# EasyEDA Pro project ProDoc_Avaota F1_2025-04-17.epro, board PCB1
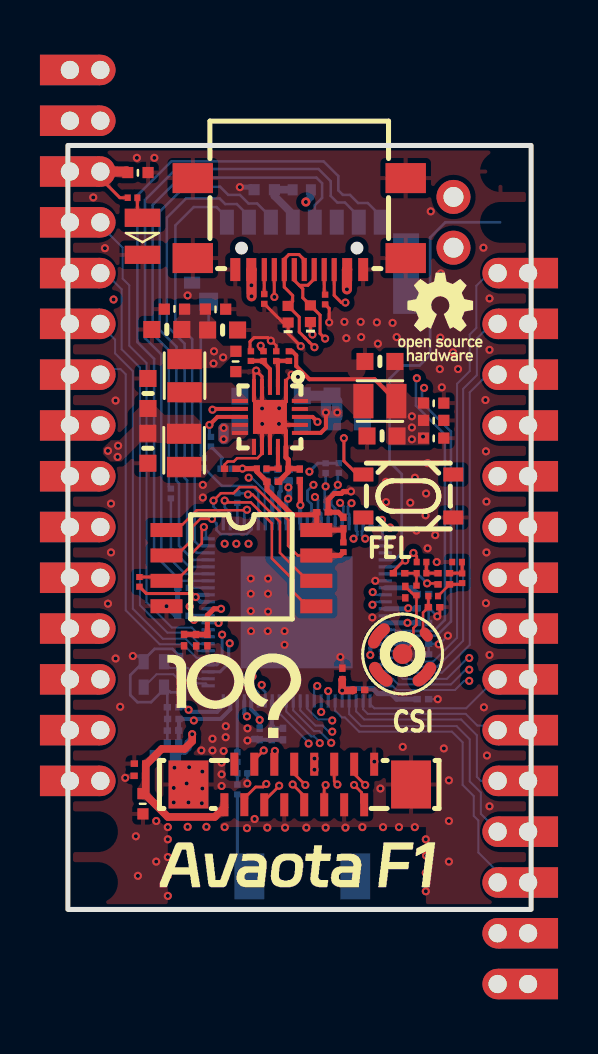
[diagram p1: board, top side]
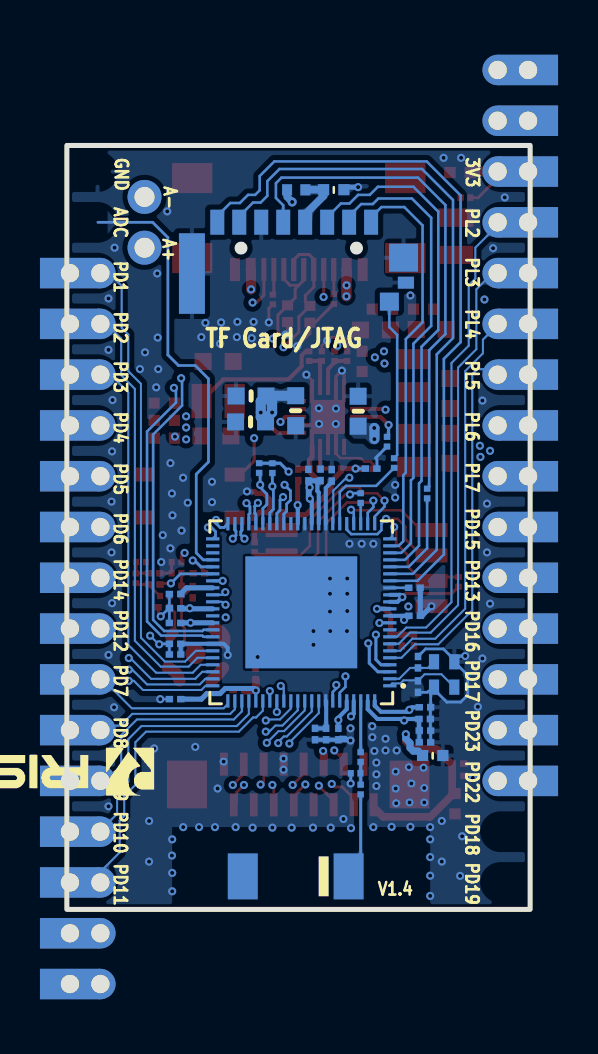
[diagram p2: board, bottom side, seen from below]

Outline 23.19 x 38.21 mm; copper layers: Top Layer, Inner1, Inner2, Inner3, Inner4, Bottom Layer. Coordinates in mm from the lower left corner of the outline.
Outline path: rectangle 0,38.21 23.19,0
Stack: Top Layer 0.035mm 外层铜厚1oz / Dielectric1 0.0994mm 3313 RC57% 4.2mil / Inner1 0.0152mm 内层铜厚 / Dielectric2 0.55mm 0.55mm H/H No copper / Inner2 0.0152mm 内层铜厚 / Dielectric3 0.1088mm 2116 RC54% 4.9mil / Inner3 0.0152mm 内层铜厚 / Dielectric4 0.55mm 0.55mm H/H No copper / Inner4 0.0152mm 内层铜厚 / Dielectric5 0.0994mm 3313 RC57% 4.2mil / Bottom Layer 0.035mm 外层铜厚1oz

## Design rules (mm)
net D0+: DP4
net D0-: DP4
net MIPIA-CSI-CK0P: DP1
net MIPIA-CSI-D0P: DP2
net MIPIA-CSI-D1P: DP3
net MIPIA-CSI-CK0N: DP1
net MIPIA-CSI-D0N: DP2
net MIPIA-CSI-D1N: DP3
template: 6L BGA
spacing safeClearance (default): track to track 0.102, other pairs 0 to 0.3
track width trackWidth (default): min 0.089, default 0.102, max 2.54
differential pair differentialPair (default): width min 0.102, default 0.254, max 2.54; gap min 0.102, default 0.102
via viaSize (default): diameter min 0.406, default 0.406, max 10; hole min 0.203, default 0.3, max 5.999
pour e3003 uses POWERCopper
pour e1913 uses POWERCopper

## Placement (name value [footprint] x y rotation side)
ANT1  CA-C03  [ANT-SMD_CA-C03]  11.74 1.65 180 bottom
C1  4.7uF  [C0201 NSK]  8.14 22.04 0 top
C2  1uF  [C0201 NSK]  11.1 21.72 270 bottom
C3  1uF  [C0201 NSK]  5.28 9.53 0 bottom
C4  1uF  [C0201 NSK]  5.78 14.69 180 bottom
C5  100nF  [C0201 NSK]  5.26 10.11 180 bottom
C10  100nF  [C0201 NSK]  17.78 10.52 0 bottom
C11  10pF  [C0201 NSK]  5.61 11.15 90 bottom
C12  10pF  [C0201 NSK]  5.61 12.37 90 bottom
C13  100nF  [C0201 NSK]  3.61 7.29 180 top
C14  100nF  [C0201 NSK]  3.59 6.68 180 top
C15  100nF  [C0201 NSK]  7.95 22.05 180 bottom
C16  100nF  [C0201 NSK]  14.58 10.97 0 top
C17  100nF  [C0201 NSK]  13.74 11.79 90 top
C18  100nF  [C0201 NSK]  10.26 21.39 0 top
C19  100nF  [C0201 NSK]  9.93 21.72 90 bottom
C20  100nF  [C0201 NSK]  10.77 8.76 270 bottom
C21  100nF  [C0201 NSK]  17.78 13.28 0 bottom
C22  100nF  [C0201 NSK]  17.78 12.75 0 bottom
C23  100nF  [C0201 NSK]  5.78 16.08 180 bottom
C24  100nF  [C0201 NSK]  10.21 8.76 270 bottom
C25  2.2uF  [C0201 NSK]  17.78 15.06 0 bottom
C26  470nF  [C0201 NSK]  17.78 15.77 0 bottom
C27  100nF  [C0201 NSK]  16.59 16.81 0 top
C28  100nF  [C0201 NSK]  18.82 16.26 0 top
C29  4.7uF  [C0201 NSK]  18.82 16.81 0 top
C30  33pF  [C0201 NSK]  16.89 15.88 90 top
C31  33pF  [C0201 NSK]  18.34 15.11 0 top
C32  100nF  [C0201 NSK]  6.42 13.46 270 top
C33  100nF  [C0201 NSK]  6.99 13.46 270 top
C34  100nF  [C0201 NSK]  5.82 13.46 270 top
C35  100nF  [C0201 NSK]  11.61 21.74 90 top
C37  100nF  [C0201 NSK]  12.75 19.86 0 top
C38  100nF  [C0201 NSK]  13.79 19.33 90 top
C39  100nF  [C0201 NSK]  5.26 8.94 180 bottom
C40  100nF  [C0201 NSK]  9.6 8.76 270 bottom
C41  100nF  [C0201 NSK]  5.26 8.36 180 bottom
C42  100nF  [C0201 NSK]  10.49 21.74 90 bottom
C43  22uF  [C0603-NSK]  4.01 23.06 90 top
C44  22uF  [C0603-NSK]  4.95 29.01 0 top
C45  22uF  [C0603-NSK]  15.73 23.68 0 top
C46  22uF  [C0603-NSK]  13.97 25.68 180 bottom
C47  22uF  [C0603-NSK]  14 24.38 180 bottom
C48  22uF  [C0603-NSK]  8.61 24.92 270 bottom
C49  22uF  [C0603-NSK]  11.74 24.94 90 bottom
C50  22uF  [C0603-NSK]  15.62 27.41 0 top
C51  22uF  [C0603-NSK]  7.75 28.98 180 top
C52  22uF  [C0603-NSK]  4.01 25.81 270 top
C53  100nF  [C0402-NSK]  4.88 7.7 0 bottom
C54  100nF  [C0402-NSK]  3.76 5.28 90 top
C55  100nF  [C0402-NSK]  3.51 36.86 180 top
C56  100nF  [C0402-NSK]  18.31 23.57 180 top
C57  100nF  [C0402-NSK]  18.31 25.32 180 top
C58  100nF  [C0402-NSK]  18.31 24.46 180 top
C59  100nF  [C0402-NSK]  5.33 30.02 0 top
C60  100nF  [C0402-NSK]  7.39 30.02 180 top
C61  100nF  [C0402-NSK]  8.41 27.41 90 top
C62  100nF  [C0201 NSK]  17.78 14.33 0 bottom
C63  100nF  [C0402-NSK]  9.83 36 0 bottom
D1  0402ESDA-05N  [D0402]  11.02 29.77 90 top
D2  0402ESDA-05N  [D0402]  12.14 29.79 90 top
H3  -  [HDR-TH_2P-P2.54-V-F]  19.3 34.37 90 top
H4  -  [2.54PHSM-1X15P]  0.36 20.4 90 top
H5  -  [2.54PHSM-1X15P]  22.78 17.86 270 top
L1  2.2uH  [IND-SMD_L2.0-W1.6]  5.82 22.96 90 top
L2  2.2uH  [IND-SMD_L2.0-W1.6]  5.84 26.7 90 top
L3  2.2uH  [IND-SMD_L2.0-W1.6]  15.62 25.43 0 top
LED1  -  [RGBLED_0807]  3.73 33.68 270 top
MIC1  MIC-4013-G-G00  [MIC-SMD_MIC-4013-G-G00]  17.35 13.26 0 top
P1  AFC11-S16ICC-00  [FPC-SMD_16P-L13.5-W2.0-P0.50]  11.61 6.25 180 top
R1  NC  [R0201 NSK]  8.74 6.81 0 bottom
R2  0  [R0201 NSK]  8.48 7.62 270 bottom
R3  0  [R0201 NSK]  8.48 5.99 270 bottom
R4  33  [R0201 NSK]  5.16 20.8 270 bottom
R5  33  [R0201 NSK]  8.48 20.57 270 bottom
R6  5.1K  [R0201 NSK]  3.24 35.6 0 top
R7  680K  [R0201 NSK]  9.7 22.05 180 top
R8  10K  [R0201 NSK]  6.81 22.33 270 bottom
R9  150K  [R0201 NSK]  10.8 22.05 180 top
R10  150K  [R0201 NSK]  9.8 27.67 90 top
R11  100K  [R0201 NSK]  9.16 27.67 270 top
R12  75K  [R0201 NSK]  11.07 27.67 90 top
R13  100K  [R0201 NSK]  10.43 27.67 270 top
R14  10K  [R0201 NSK]  3.58 16.38 270 top
R15  5.1K  [R0201 NSK]  9.83 30.53 90 top
R16  5.1K  [R0201 NSK]  12.88 30.51 270 top
R17  10K  [R0201 NSK]  13.79 18.11 270 top
R18  1.5K  [R0201 NSK]  17.7 16.81 0 top
R19  1.5K  [R0201 NSK]  19.74 16.56 90 top
R20  33  [R0201 NSK]  17.45 15.95 270 top
R21  33  [R0201 NSK]  18.29 15.67 180 top
R22  1K  [R0201 NSK]  19.48 17.37 0 top
R23  1K  [R0201 NSK]  17.7 17.37 180 top
R24  2K  [R0201 NSK]  12.9 22.07 270 bottom
R25  2K  [R0201 NSK]  13.56 22.08 270 bottom
R26  10K  [R0201 NSK]  7.16 23.39 90 bottom
R27  1  [R0402-NSK]  11.71 35.99 0 bottom
SW1  TS3425BA  [SW-SMD_4P-L4.2-W3.2-P2.15-LS4.6-1]  17.04 20.68 180 top
U1  V821x2-xXX  [QFN-88_L9.0-W9.0-P0.35-BL-EP5.26]  11.46 14.86 90 bottom
U2  MUP-M617-2  [TF-SMD_MUP-M617-2]  11.18 32.39 180 bottom
U3  EA3036CQBR  [WQFN-20_L3.0-W3.0-P0.40-BL-EP]  10.12 24.63 180 top
U4  PY25Q128HA-SUH-IT  [SOP-8_L5.2-W5.3-P1.27-LS7.9-BL]  8.69 17.07 270 top
USB1  TYPE-C 16P QTGM027  [USB-C-SMD_TYPE-C-16P-QTGM027]  11.58 34.29 180 top
X1  40MHz  [osc-smd_4p-l2.0-w1.6-bl]  4.3 11.75 90 bottom

## Footprints (pads in the part's own frame, mm; a bottom-side part is the same pattern mirrored in y, then rotated)
2.54PHSM-1X15P
  rect 1.524x3 hole 0.914: 1(21.59,0.254) 2(19.05,0.254) 3(16.51,0.254) 4(13.97,0.254) 5(11.43,0.254) 6(8.89,0.254) 7(6.35,0.254) 8(3.81,0.254) 9(1.27,0.254) 10(-1.27,0.254) 11(-3.81,0.254) 12(-6.35,0.254) 13(-8.89,0.254) 14(-11.43,0.254) 15(-13.97,0.254)
  round 1.524 hole 0.914: 1(21.59,-1.27) 2(19.05,-1.27) 3(16.51,-1.27) 4(13.97,-1.27) 5(11.43,-1.27) 6(8.89,-1.27) 7(6.35,-1.27) 8(3.81,-1.27) 9(1.27,-1.27) 10(-1.27,-1.27) 11(-3.81,-1.27) 12(-6.35,-1.27) 13(-8.89,-1.27) 14(-11.43,-1.27) 15(-13.97,-1.27)
ANT-SMD_CA-C03
  rect 1.5x2.3 smd: 1(-2.65,0) 2(2.65,0)
C0201 NSK
  rect 0.368x0.324 smd: 1(-0.292,0) 2(0.28,0)
C0402-NSK
  rect 0.559x0.559 smd: 1(-0.508,0) 2(0.508,0)
C0603-NSK
  rect 0.85x0.85 smd: 1(-0.75,0) 2(0.75,0)
D0402
  rect 0.505x0.551 smd: 1(-0.416,0) 2(0.416,0)
FPC-SMD_16P-L13.5-W2.0-P0.50
  rect 0.4x1.15 smd: 1(-3.725,-1.012) 2(-3.225,1.016) 3(-2.724,-1.012) 4(-2.224,1.016) 5(-1.726,-1.012) 6(-1.224,1.016) 7(-0.726,-1.012) 8(-0.223,1.016) 9(0.276,-1.012) 10(0.775,1.016) 11(1.274,-1.012) 12(1.776,1.016) 13(2.274,-1.014) 14(2.774,1.011) 15(3.272,-1.016) 16(3.772,1.014)
  rect 2x2.4 smd: 17(5.572,0.001) 18(-5.572,0)
HDR-TH_2P-P2.54-V-F
  round 1.7 hole 1: 1(-1.27,0) 2(1.27,0)
IND-SMD_L2.0-W1.6
  rect 1x1.72 smd: 1(0.828,0) 2(-0.828,0)
MIC-SMD_MIC-4013-G-G00
  round 1 smd: 1(-0.591,-0.485)
  oval 0.508x0.762 smd rot 39: 2(0.591,0.485)
osc-smd_4p-l2.0-w1.6-bl
  rect 0.762x0.508 smd: 1(-0.635,-0.508) 2(0.635,-0.508) 3(0.635,0.508) 4(-0.635,0.508)
QFN-88_L9.0-W9.0-P0.35-BL-EP5.26
  rect 0.16x0.665 smd: 1(-3.675,-4.433) 2(-3.325,-4.433) 3(-2.975,-4.433) 4(-2.625,-4.433) 5(-2.275,-4.433) 6(-1.925,-4.433) 7(-1.575,-4.433) 8(-1.225,-4.433) 9(-0.875,-4.433) 10(-0.525,-4.433) 11(-0.175,-4.433) 12(0.175,-4.433) 13(0.525,-4.433) 14(0.875,-4.433) 15(1.225,-4.433) 16(1.575,-4.433) 17(1.925,-4.433) 18(2.275,-4.433) 19(2.625,-4.433) 20(2.975,-4.433) 21(3.325,-4.433) 22(3.675,-4.433) 45(3.675,4.433) 46(3.325,4.433) 47(2.975,4.433) 48(2.625,4.433) 49(2.275,4.433) 50(1.925,4.433) 51(1.575,4.433) 52(1.225,4.433) 53(0.875,4.433) 54(0.525,4.433) 55(0.175,4.433) 56(-0.175,4.433) 57(-0.525,4.433) 58(-0.875,4.433) 59(-1.225,4.433) 60(-1.575,4.433) 61(-1.925,4.433) 62(-2.275,4.433) 63(-2.625,4.433) 64(-2.975,4.433) 65(-3.325,4.433) 66(-3.675,4.433)
  rect 0.665x0.16 smd: 23(4.433,-3.675) 24(4.433,-3.325) 25(4.433,-2.975) 26(4.433,-2.625) 27(4.433,-2.275) 28(4.433,-1.925) 29(4.433,-1.575) 30(4.433,-1.225) 31(4.433,-0.875) 32(4.433,-0.525) 33(4.433,-0.175) 34(4.433,0.175) 35(4.433,0.525) 36(4.433,0.875) 37(4.433,1.225) 38(4.433,1.575) 39(4.433,1.925) 40(4.433,2.275) 41(4.433,2.625) 42(4.433,2.975) 43(4.433,3.325) 44(4.433,3.675) 67(-4.433,3.675) 68(-4.433,3.325) 69(-4.433,2.975) 70(-4.433,2.625) 71(-4.433,2.275) 72(-4.433,1.925) 73(-4.433,1.575) 74(-4.433,1.225) 75(-4.433,0.875) 76(-4.433,0.525) 77(-4.433,0.175) 78(-4.433,-0.175) 79(-4.433,-0.525) 80(-4.433,-0.875) 81(-4.433,-1.225) 82(-4.433,-1.575) 83(-4.433,-1.925) 84(-4.433,-2.275) 85(-4.433,-2.625) 86(-4.433,-2.975) 87(-4.433,-3.325) 88(-4.433,-3.675)
  rect 5.6x5.6 smd: 89(0,0)
R0201 NSK
  rect 0.303x0.324 smd: 1(-0.241,0) 2(0.241,0)
R0402-NSK
  rect 0.5x0.559 smd: 1(-0.457,0) 2(0.458,0)
RGBLED_0807
  rect 0.91x1.778 smd: 1(-0.914,0) 2(0.94,0)
SOP-8_L5.2-W5.3-P1.27-LS7.9-BL
  rect 0.7x1.6 smd: 1(-1.905,-3.75) 2(-0.635,-3.75) 3(0.635,-3.75) 4(1.905,-3.75) 5(1.905,3.75) 6(0.635,3.75) 7(-0.635,3.75) 8(-1.905,3.75)
SW-SMD_4P-L4.2-W3.2-P2.15-LS4.6-1
  rect 1x0.7 smd: 1(-2.25,1.075) 2(2.25,1.075) 3(-2.25,-1.075) 4(2.25,-1.075)
TF-SMD_MUP-M617-2
  rect 0.7x1.25 smd: 1(3.215,1.988) 2(2.115,1.988) 3(1.015,1.988) 4(-0.085,1.988) 5(-1.185,1.988) 6(-2.285,1.988) 7(-3.385,1.988) 8(-4.485,1.988)
  rect 0.81x0.6 smd: 9(4.96,-1.038)
  rect 0.95x0.9 smd: 10(4.13,-1.988)
  rect 1.45x1.4 smd: 11(4.84,0.212)
  rect 1.3x4.03 smd: 12(-5.755,-0.583)
USB-C-SMD_TYPE-C-16P-QTGM027
  rect 2.02x1.5 smd: 17(5.33,1.712) 18(5.33,-2.288) 19(-5.33,-2.288) 20(-5.33,1.712)
  rect 0.5x1.15 smd: A1(-3.2,2.288) A4(-2.4,2.288) A9(2.4,2.288) A12(3.2,2.288)
  rect 0.26x1.15 smd: A5(-1.25,2.288) A6(-0.25,2.288) A7(0.25,2.288) A8(1.25,2.288) B5(1.75,2.288) B6(0.75,2.288) B7(-0.75,2.288) B8(-1.75,2.288)
WQFN-20_L3.0-W3.0-P0.40-BL-EP
  rect 0.2x0.8 smd: 1(-0.8,-1.5) 2(-0.4,-1.5) 3(0,-1.5) 4(0.4,-1.5) 5(0.8,-1.5) 11(0.8,1.5) 12(0.4,1.5) 13(0,1.5) 14(-0.4,1.5) 15(-0.8,1.5)
  rect 0.8x0.2 smd: 6(1.5,-0.8) 7(1.5,-0.4) 8(1.5,0) 9(1.5,0.4) 10(1.5,0.8) 16(-1.5,0.8) 17(-1.5,0.4) 18(-1.5,0.001) 19(-1.5,-0.4) 20(-1.5,-0.8)
  rect 1.7x1.7 smd: 21(0,0)

## Nets
0V9: C19.1 C20.1 C21.1 C22.1 C23.1 C24.1 C45.2 C50.2 C56.2 C57.2 C58.2 L3.1 R12.2 U1.15 U1.30 U1.33 U1.60 U1.81
1V5: C2.2 C3.2 C39.1 C40.1 C41.1 C42.1 C44.2 C51.2 C59.2 C60.2 C61.2 L2.1 R10.2 U1.31 U1.32 U1.84 U1.87
1V8: C32.1 C33.1 C34.1 C35.1 R24.1 R25.1 U1.12 U1.34
1V8-AON: C4.1 C5.1 U1.11 U1.88
3V3: C1.2 C10.1 C13.1 C14.1 C15.1 C16.1 C17.1 C18.1 C37.1 C38.1 C43.2 C52.2 C53.2 C54.2 C55.2 C62.1 H4.1 L1.1 P1.16 R6.1 R7.2 R14.2 R17.1 R27.2 U1.13 U1.14 U1.57 U1.71 U1.85 U4.8
AVCC: C25.1 R23.2 U1.55
GND: C1.1 C2.1 C3.1 C4.2 C5.2 C10.2 C11.1 C12.2 C13.2 C14.2 C15.2 C16.2 C17.2 C18.2 C19.2 C20.2 C21.2 C22.2 C23.2 C24.2 C25.2 C26.2 C30.1 C31.2 C32.2 C33.2 C34.2 C35.2 C37.2 C38.2 C39.2 C40.2 C41.2 C42.2 C43.1 C44.1 C45.1 C46.1 C47.1 C48.1 C49.1 C50.1 C51.1 C52.1 C53.1 C54.1 C55.1 C56.1 C57.1 C58.1 C59.1 C60.1 C61.1 C62.2 C63.1 D1.1 D2.1 H5.15 LED1.2 P1.1 P1.4 P1.7 P1.10 P1.17 P1.18 R1.2 R9.1 R11.1 R13.1 R15.1 R16.2 R22.1 R26.1 SW1.1 U1.51 U1.89 U2.6 U2.9 U2.11 U2.12 U3.1 U3.4 U3.5 U3.12 U3.13 U3.15 U3.17 U3.21 U4.4 USB1.17 USB1.18 USB1.19 USB1.20 USB1.A1 USB1.A12 X1.2 X1.4
VBUS: C46.2 C47.2 C48.2 C49.2 U3.7 U3.9 U3.10 U3.16 U3.19 USB1.A4 USB1.A9
D0+: D1.2 U1.59 USB1.A6 USB1.B6
D0-: D2.2 U1.58 USB1.A7 USB1.B7
FEL: SW1.4 U1.29
GPADC0: H5.14 U1.48
HXIN: C11.2 U1.1 X1.1
HXOUT: C12.1 U1.2 X1.3
LINEOUTN: H3.2 U1.54
LINEOUTP: H3.1 U1.53
MICINN: C28.1 U1.50
MICINP: C27.1 U1.49
MIPIA-CSI-CK0N: P1.8 U1.40
MIPIA-CSI-CK0P: P1.9 U1.41
MIPIA-CSI-D0N: P1.2 U1.42
MIPIA-CSI-D0P: P1.3 U1.43
MIPIA-CSI-D1N: P1.5 U1.44
MIPIA-CSI-D1P: P1.6 U1.45
MIPIA_MCLK: P1.12 U1.36
MIPIA_RSTN: P1.11 U1.37
PD1: H5.13 U1.61
PD2: H5.12 U1.62
PD3: H5.11 U1.63
PD4: H5.10 U1.64
PD5: H5.9 U1.65
PD6: H5.8 U1.66
PD7: H5.5 U1.67
PD8: H5.4 U1.68
PD9: H5.3 U1.69
PD10: H5.2 U1.70
PD11: H5.1 U1.72
PD12: H5.6 U1.73
PD13: H4.9 U1.74
PD14: H5.7 U1.75
PD15: H4.8 U1.76
PD16: H4.10 U1.77
PD17: H4.11 U1.78
PD18: H4.14 U1.79
PD19: H4.15 U1.80
PD22: H4.13 U1.82
PD23: H4.12 U1.83
PL2: H4.2 U1.8
PL3: H4.3 U1.7
PL6: H4.6 U1.4
PL7: H4.7 U1.3
PMC_EN0: R26.2 U1.10 U3.8 U3.18
SDC0_CLK: R4.1 U2.5
SDC0_CMD: U1.19 U2.3
SDC0_D0: U1.17 U2.7
SDC0_D1: U1.16 U2.8
SDC0_D2: U1.21 U2.1
SDC0_D3: U1.20 U2.2
SDC0_DC: R8.2 U1.28
SPI0_CLK: R5.1 U4.6
SPI0_CS: U1.26 U4.1
SPI0_HOLD: R17.2 U1.23 U4.7
SPI0_MISO: U1.27 U4.2
SPI0_MOSI: U1.24 U4.5
SPI0_WP: R14.1 U1.22 U4.3
TWI0_SCK: P1.13 R24.2 U1.38
TWI0_SDA: P1.14 R25.2 U1.39
UART0_RX: H4.5 U1.5 USB1.A8
UART0_TX: H4.4 U1.6 USB1.B8
VRA1: C26.1 U1.52
$1N29215: R2.1 U1.86
$1N78208: C63.2 R27.1 U2.4
$1N78221: R8.1 U2.10
$1N78347: R1.1 R2.2 R3.1
$1N78353: ANT1.2 R3.2
$1N79510: LED1.1 R6.2
$1N80715: R15.2 USB1.B5
$1N80801: R16.1 USB1.A5
$1N82766: R7.1 R9.2 U3.14
$1N82929: L1.2 U3.11
$1N83072: R10.1 R11.2 U3.3
$1N83076: L2.2 U3.6
$1N83335: R12.1 R13.2 U3.2
$1N83339: L3.2 U3.20
$1N83538: R4.2 U1.18
$1N83564: R5.2 U1.25
$1N85174: C27.2 R18.1 R20.1
$1N85232: C29.1 R18.2 R23.1
$1N85237: C28.2 R19.1 R21.1
$1N85241: C29.2 R19.2 R22.2
$1N85511: C31.1 MIC1.2 R21.2
$1N85515: C30.2 MIC1.1 R20.2

Pads without a net: ANT1 1; P1 15; SW1 2 3; U1 9 35 46 47 56

## Via types
v1: diameter 0.406, hole 0.203, Top Layer to Bottom Layer, 238 vias
v2: diameter 0.457, hole 0.203, Top Layer to Bottom Layer, 1 via

## Routing (per net, layer and track width the routed paths; a pad name or vN(x,y) marks a point on that pad's centre or on a via; arc(x,y) is an arc through that point)
0V9: length 31.6
  Top Layer w0.203: L3.1 15.36,26.52 12.09,26.52 11.43,27.18 11.43,27.71 11.23,27.92 R12.2
  Inner3 w0.914: 16.47,22.76 16.89,22.76 v1(17.78,23.65) 17.68,23.65 v1(17.22,24.1) ; 16.47,22.76 11.25,22.76 9.86,21.36 9.86,19.1 v1(9.04,18.29) v1(8.43,18.29) v1(7.85,18.29) ; 16.47,22.76 v1(17.22,23.51) v1(17.22,24.1) ; v1(17.22,24.1) v1(17.22,24.66)
  Bottom Layer w0.127: C23.1 U1.15
  Bottom Layer w0.203: C20.1 C24.1 10.21,10.41 U1.81 ; U1.30 10.23,21.08 9.93,21.38 C19.1 ; C22.1 C21.1 U1.60 15.34,13.28 15.14,13.08 v1(15.14,12.72)
1V5: length 47.1
  Top Layer w0.254: R10.2 9.65,28.06 v1(9.65,28.19)
  Inner2 w0.254: v1(9.65,28.19) 7.59,28.19 v1(7.32,27.91)
  Inner2 w0.508: 6.76,10.67 7.32,11.23 8.79,11.23 9.63,10.39 9.63,9.5 v1(9.6,9.47) ; 6.76,10.67 6.68,10.59 6.68,9.82 v1(6.31,9.45) ; 6.76,10.67 6.76,13.92 6.98,14.14 6.98,18.23 7.7,18.95 9.37,18.95 10.65,20.23 ; 10.65,20.23 10.99,20.56 ; 10.65,20.23 10.65,20.43 10.78,20.56 10.99,20.56 ; 10.99,20.56 11.01,20.54 v1(11.03,20.54) ; 10.65,20.43 10.65,20.92
  Inner2 w0.762: 10.65,20.92 10.65,21.66 8.74,23.57 8.74,25.86 v1(7.29,27.31) ; v1(7.29,27.31) 7.47,27.31 8.69,26.08 8.69,26.69 v1(7.77,27.61) 7.47,27.91 v1(7.32,27.91) 7.29,27.89 v1(7.29,27.31)
  Bottom Layer w0.203: 5.46,9.04 5.55,8.95 5.55,8.43 ; 5.55,8.97 5.56,8.98 5.56,9.53 6.23,9.53 v1(6.31,9.45) 6.38,9.53 7.65,9.53 8.13,10.01 U1.87 ; U1.84 9.18,10.01 9.6,9.59 v1(9.6,9.47) C40.1 ; C2.2 11.04,21.38 v1(11.04,21.11) 11.04,20.58 11.05,20.57 ; U1.32 10.93,20.45 v1(11.03,20.54) ; U1.31 10.58,20.85 10.65,20.92 10.65,21.29 10.5,21.44
  Bottom Layer w0.254: v1(11.03,20.54) 11.05,20.57 11.1,20.61 C2.2 10.5,21.44 C42.1
1V8: length 16.7
  Top Layer w0.254: C34.1 6.42,13.75 C32.1 6.98,13.75 C33.1 6.99,14.71 7.31,15.03 v1(7.67,15.03) ; C35.1 11.64,21.42 v1(11.64,20.22)
  Inner2 w0.508: v1(12.09,21.89) 11.64,21.44 v1(11.64,20.22) 11.64,20.09 9.27,17.73 8.18,17.73 7.77,17.32 7.77,15.14 v1(7.67,15.03)
  Bottom Layer w0.152: R25.1 13.56,22.31 R24.1 12.51,22.31 v1(12.09,21.89)
  Bottom Layer w0.203: U1.12 v1(7.67,15.03) ; U1.34 11.63,20.21 v1(11.64,20.22)
1V8-AON: length 8.5
  Inner2 w0.254: v1(6.31,14.48) 6.05,14.21 v1(6.05,9.98)
  Bottom Layer w0.203: U1.88 7.78,10.19 7.47,9.88 6.15,9.88 v1(6.05,9.98) 5.92,10.11 5.58,10.11 ; U1.11 6.1,14.69
  Bottom Layer w0.254: v1(6.31,14.48) 6.1,14.69 C4.1
3V3: length 114.2
  Top Layer w0.152: v1(6.4,15.62) 6.22,15.8 3.92,15.8 R14.2 ; 3,35.6 2.6,35.6 1.49,36.72 1.49,36.91
  Top Layer w0.254: 8.42,22.04 8.73,22.04 v1(8.74,22.05) R7.2 9.46,21.89 C18.1 9.97,20.99 11.23,19.74 12.33,19.74 C37.1 12.46,19 U4.8 13.73,18.97 C38.1 R17.1
  Top Layer w0.381: C17.1 13.73,11.48 v1(13.73,10.95) 14.26,10.95 C16.1 ; 3.94,7.26 4.7,8.03 5.84,8.03 6.22,8.41 v1(6.22,8.76) ; P1.16 7.84,5.11 7.35,4.62 5,4.62 3.9,5.73 C13.1
  Top Layer w0.508: C55.2 2.95,36.91 1.49,36.91
  Inner2 w0.381: 6.07,15.17 6.4,15.49 v1(6.4,15.62) ; 5.54,14.63 5.54,14.58 ; 6.05,8.79 6.55,8.79 7.29,9.53 7.29,10.29 7.62,10.62 8.53,10.62 8.97,10.19 v1(8.97,9.65) ; 6.07,21.52 6.13,21.52 6.66,22.05 ; 5.99,22.66 5.82,22.66
  Inner2 w0.635: 5.64,22.05 5.21,22.48 ; 5.64,22.05 6.07,21.62 6.07,15.16 ; 5.64,22.05 6.43,22.05 ; 5.29,23.19 5.82,22.66 ; 5.29,23.19 v1(2.51,23.19) ; 5.29,23.19 6.12,24.02 6.12,25.91 5.41,26.62 5.41,28.91 7.29,30.78 7.29,33.25 ; 5.82,22.66 5.8,22.63 v1(2.49,22.63) 2.31,22.63 v1(2.01,22.94) ; 5.82,22.66 6.43,22.05 ; v1(2.51,23.19) 2.26,23.19 v1(2.01,22.94) ; v1(2.51,23.19) 2.26,22.94 v1(2.01,22.94) ; 6.43,22.05 8.62,22.05 ; 6.07,15.16 6.08,15.15 v1(6.1,15.15) 5.69,14.75 5.69,14.73 5.54,14.58 5.54,14.58 5.42,14.47 5.42,9.26 5.92,8.76 ; 6.07,15.16 6.07,15.17 ; 7.29,33.25 5.13,35.41 2.99,35.41 1.49,36.91 ; 7.29,33.25 8.41,34.37 10.9,34.37 v2(11.91,35.38)
  Inner3 w0.381: v1(13.73,10.95) 15.7,10.95 17,12.25 v1(17,14.33)
  Inner3 w0.508: v1(17,14.33) 16.83,14.5 16.81,14.5 16.38,14.93 16.38,16.48 15.54,17.32 7.72,17.32 6.4,16 v1(6.4,15.62) 6.4,15.45 v1(6.1,15.15)
  Bottom Layer w0.127: C15.1 v1(8.74,22.05)
  Bottom Layer w0.203: v1(8.97,9.65) 8.83,9.79 U1.85 ; U1.14 6.51,15.73 v1(6.4,15.62) 6.64,15.38 U1.13
  Bottom Layer w0.254: 17.47,14.33 v1(17,14.33) U1.57 ; C10.1 16.46,10.52 16.18,10.8 15.52,10.8 15.27,11.05 13.83,11.05 v1(13.73,10.95)
  Bottom Layer w0.355: v1(6.22,8.76) 6.22,8.53 6.01,8.33 6.01,8.08 5.85,7.92 5.6,7.92 C53.2 ; R27.2 12.17,35.64 v2(11.91,35.38)
AVCC: length 5.1
  Top Layer w0.137: R23.2 17.46,17.67 v1(17.3,17.83)
  Inner2 w0.254: v1(17.04,15.06) 17.17,15.2 17.17,17.04 17.32,17.2 17.32,17.81 v1(17.3,17.83)
  Bottom Layer w0.254: 17.01,15.03 v1(17.04,15.06) ; 17.01,15.03 17.49,15.03 17.51,15.06 ; 17.01,15.03 U1.55
GND: length 49.4
  Top Layer w0.127: U3.12 9.72,22.79 9.49,22.57 8.47,22.57 8.31,22.4 8,22.4 7.84,22.25 C1.1 ; C31.2 18.62,14.78 v1(18.49,14.66) ; R13.1 10.43,28.2 10.26,28.37 ; v1(11.2,26.75) 10.92,26.46 U3.1
  Top Layer w0.152: v1(13.08,29.36) 13.08,30.06 R16.2 ; U3.5 9.32,26.84 v1(9.42,26.95) 9.72,26.66 U3.4 ; v1(11.66,28.17) 11.02,28.8 D1.1 10.77,29.35 R15.1 ; v1(10.16,28.45) 10.01,28.6 9.32,28.6 9.12,28.4 9.12,27.96 R11.1 ; 12.14,29.38 12.14,28.86 v1(12.24,28.75)
  Top Layer w0.203: v1(10.16,28.45) 10.24,28.37 10.26,28.37 ; U3.5 9.32,25.46 v1(9.72,25.05) ; 10.62,24.23 10.92,23.93 U3.15 ; 10.62,24.23 U3.17 ; 10.62,24.23 v1(10.57,24.28) 10.12,23.83 U3.13 ; v1(9.72,25.05) 9.72,26.13 U3.4 ; v1(9.72,25.05) 9.73,25.05 v1(9.73,24.28) 9.72,24.27 U3.12 ; U3.1 10.92,25.41 v1(10.58,25.07)
  Top Layer w0.254: v1(14.17,20.9) 13.79,20.9 13.69,20.8 13.34,20.8 13.03,20.5 C37.2 13.54,19.86 C38.2 ; R9.1 11.04,21.88 C18.2 ; R9.1 11.04,22.49 10.92,22.61 U3.15 ; R9.1 11.58,22.05 C35.2
  Bottom Layer w0.102: v1(18.57,13.26) 18.59,13.26 v1(19.02,13.69) ; C10.2 v1(18.52,10.52)
  Bottom Layer w0.127: 18.09,15.06 C25.2 18.06,14.35 ; 18.09,15.06 v1(18.49,14.66) ; 18.09,15.06 18.06,15.09 C26.2 ; C15.2 7.67,22.52 7.73,22.58 ; v1(18.57,13.26) 18.54,13.28 C21.2 C22.2
  Bottom Layer w0.137: X1.2 3.12,11.72 3.12,10.72 3.48,10.36 4.17,10.36 4.81,11.01 X1.4 4.98,10.95 C5.2 4.99,10.1 4.99,8.95 C39.2 C41.2 ; X1.2 3.51,12.67 v1(3.25,12.67) ; X1.2 3.79,12.48 4.34,13.03 5.23,13.03 C12.2 ; C11.1 5.14,10.86 5.08,10.92 ; R1.2 8.98,6.81 v1(8.98,6.3) ; U1.51 v1(15.39,16.43)
  Bottom Layer w0.152: 7.73,22.58 R26.1
  Bottom Layer w0.203: C20.2 C24.2 C40.2 9.5,8.58 9.25,8.58
  Bottom Layer w0.254: C23.2 5.5,16.08 C4.2 5.42,14.69 v1(4.94,15.16) ; C63.1 9.19,36.13 v1(8.61,36.13) ; v1(8.99,8.45) 9.03,8.48 C40.2
  vias: v1(1.27,35.61) v1(1.85,33.07) v1(2.01,15.29) v1(2.16,20.29) v1(2.16,17.86) v1(2.39,25.45) v1(2.39,12.55) v1(2.62,10.13) v1(2.87,6.58) v1(3.45,37.59) v1(3.4,3.66) v1(3.51,1.68) v1(4.33,37.59) v1(4.42,4.42) v1(4.42,2.39) v1(5,4.11) v1(5,3.51) v1(5,2.62) v1(5,1.69) v1(5,0.67) v1(5.33,7.09) v1(5.3,6.07) v1(5.3,5.35) v1(5.95,6.3) v1(5.99,30.71) v1(6.07,7.11) v1(6.04,5.35) v1(5.99,4.13) v1(6.76,21.23) v1(6.76,20.6) v1(6.68,7.95) v1(6.73,6.89) v1(6.73,6.05) v1(6.71,5.31) v1(6.93,4.13) v1(7.24,8.53) v1(7.24,7.95) v1(7.7,7.34) v1(7.7,6.76) v1(7.7,6.17) v1(7.8,7.92) v1(7.85,4.11) v1(7.91,9.16) v1(7.9,8.61) v1(8.97,4.06) v1(8.99,9.06) v1(9.16,16.55) v1(9.16,15.79) v1(9.16,14.92) v1(9.17,13.92) v1(9.35,4.52) v1(10.02,16.55) v1(10.02,15.79) v1(10.02,14.9) v1(10.01,13.92) v1(9.98,4.09) v1(10.85,13.92) v1(10.85,13.23) v1(10.87,4.09) v1(11.94,4.09) v1(12.34,7.54) v1(12.34,6.98) v1(12.9,4.09) v1(13.64,12.62) v1(13.84,29.39) v1(13.94,28.57) v1(13.89,4.09) v1(14.66,29.39) v1(14.68,28.63) v1(14.74,4.11) v1(15.24,14.61) v1(15.34,7.39) v1(15.47,29.36) v1(15.52,28.3) v1(15.65,6.05) v1(15.78,4.11) v1(15.93,21.39) v1(15.93,20.37) v1(16.26,29.34) v1(16.46,28.63) v1(16.58,4.11) v1(16.76,8.13) v1(17.14,20.34) v1(17.37,21.59) v1(17.37,4.11) v1(17.45,18.95) v1(17.93,20.8) v1(17.91,19.71) v1(17.92,3.5) v1(17.93,2.69) v1(17.92,1.82) v1(17.92,0.9) v1(18.01,22.32) v1(18.01,18.06) v1(18.17,34.91) v1(18.39,18.72) v1(18.47,17.37) v1(18.67,31.81) v1(18.64,28.6) v1(18.62,27.03) v1(18.72,26.11) v1(18.82,8.05) v1(19.07,6.45) v1(19.07,4.42) v1(19.07,2.39) v1(19.28,27.86) v1(19.53,27.03) v1(20.8,33.1) v1(20.83,10.11) v1(20.9,25.48) v1(20.93,22.91) v1(20.96,20.4) v1(20.96,17.86) v1(20.93,15.32) v1(20.98,7.7) v1(21.11,30.56) v1(21.11,27.99) v1(21.11,12.73) v1(21.11,5.16)
VBUS: length 39.7
  Top Layer w0.203: U3.16 12.66,23.83 12.92,24.09 v1(12.92,24.85) ; v1(7.24,24.99) 7.28,25.03 U3.7
  Top Layer w0.508: v1(13.97,31.01) 13.97,31.99 USB1.A4 ; v1(9.19,30.67) 9.19,31.99 USB1.A9
  Inner2 w0.635: 7.8,24.07 7.86,24.13 7.86,25.51 7.46,25.92 ; 7.8,24.07 7.8,24.43 v1(7.24,24.99) 7.24,25.69 7.46,25.92 ; 7.8,24.07 7.8,24.06 v1(7.8,23.52) ; 8.38,29.03 6.96,29.03 6.43,28.5 6.43,26.95 7.46,25.92 ; 8.38,29.03 8.56,29.03 8.64,29.11 ; 8.38,29.03 8.64,29.11 ; v1(13.97,31.01) 13.53,31.01 13.21,31.33 9.3,31.33 v1(9.19,31.22) 9.19,30.67 v1(9.19,30.67) 9.19,29.67 8.64,29.11 ; 8.64,29.11 8.64,29.1 10.63,29.1 10.79,28.93 10.79,27.84 10.06,27.1 10.06,26.31 10.49,25.88 12.45,25.88 v1(13.48,24.85) v1(12.92,24.85) 12.92,25.01 12.22,25.7
  Bottom Layer w0.508: v1(7.8,24.08) 7.8,24.07 v1(7.8,23.52) ; C46.2 13.21,25.69 C49.2 ; C46.2 13.48,25.42 v1(13.48,24.85) 13.48,24.62 C47.2 13.25,24.53 v1(12.92,24.85) 12.92,25.38 C46.2
D0+: length 29.8
  Top Layer w0.152: USB1.A6 11.83,32.49 11.57,32.76 11.06,32.76 10.83,32.52 USB1.B6 10.83,31.13 11.25,30.71 11.25,30.41 D1.2 11.58,29.63 11.58,28.88 11.86,28.6 11.86,28.6 12.09,28.37 12.09,28.37 v1(12.34,28.12)
  Inner2 w0.137: v1(12.34,28.12) 12.55,28.12 12.84,27.82 13.12,27.82 13.88,27.05 13.88,26.55 14.75,25.68 17.17,25.68 17.58,26.09 v1(17.83,26.09)
  Bottom Layer w0.127: v1(17.83,26.09) 17.73,25.98 17.73,25.35 19.18,23.9 19.18,14.4 18.47,13.69 16.41,13.69 16.35,13.63 U1.59
D0-: length 28
  Top Layer w0.152: USB1.B7 12.33,31.53 12.01,31.22 11.58,31.22 ; v1(12.88,28.55) 12.62,28.8 12.62,29.73 D2.2 11.76,30.59 11.76,31.04 11.58,31.22 ; 11.58,31.22 11.33,31.47 USB1.A7
  Inner2 w0.137: v1(12.88,28.55) 12.88,28.16 12.98,28.06 13.21,28.06 14.12,27.15 14.12,26.64 14.85,25.92 17.07,25.92 17.47,26.31 v1(17.47,26.57)
  Bottom Layer w0.127: v1(17.47,26.57) 17.47,26.46 17.42,26.42 17.42,25.2 18.87,23.75 18.87,14.48 18.32,13.92 16.41,13.92 16.35,13.98 U1.58
FEL: length 10.7
  Top Layer w0.152: v1(13.82,23.57) 13.82,22.43 14.5,21.75 SW1.4
  Inner3 w0.152: v1(9.05,21.59) 11.03,23.57 v1(13.82,23.57)
  Bottom Layer w0.102: U1.29 9.86,19.32 9.86,20.94 9.2,21.59 v1(9.05,21.59)
GPADC0: length 22.1
  Bottom Layer w0.137: 21.64,34.37 18.9,34.37 18.14,33.6 18.14,27.74 17.6,27.2 16.76,27.2 16.1,26.54 16.1,22.38 16.71,21.77 16.71,17.83 16.37,17.48 U1.48
HXIN: length 3.8
  Bottom Layer w0.102: U1.1 6.91,11.3 6.5,11.3 6.34,11.46 5.69,11.46 5.61,11.38 5.61,11.35 ; C11.2 5.28,11.76 4.44,11.76 X1.1
HXOUT: length 2.6
  Bottom Layer w0.102: U1.2 6.55,11.53 6.01,12.08 C12.1 5.12,12.08 X1.3
LINEOUTN: length 24.2
  Inner1 w0.137: v1(15.25,15.24) 15.44,15.24 16.28,16.08 16.28,18.01 16.97,18.69 16.97,19.51 16.74,19.74 16.74,22 16.46,22.28 16.46,27.1 20.37,31.01 20.37,34.57 H3.2
  Bottom Layer w0.102: v1(15.25,15.24) 15.38,15.37 15.41,15.37 15.43,15.38 U1.54
LINEOUTP: length 20.7
  Inner1 w0.137: 16.05,27.28 16.05,27.31 ; 16.05,27.28 19.96,31.19 19.96,32.44 H3.1 ; 16.05,27.28 16.05,22.07 16.38,21.74 16.38,19.53 16.6,19.32 16.6,18.93 15.85,18.19 15.85,16.46 15.76,16.37 15.76,16.28 15.54,16.06 15.45,16.06 v1(15.26,15.87)
  Bottom Layer w0.102: v1(15.26,15.87) 15.4,15.73 U1.53
MICINN: length 2.9
  Top Layer w0.127: v1(17.98,16.31) 18.48,16.31 C28.1
  Bottom Layer w0.137: U1.50 17.51,16.78 v1(17.98,16.31)
MICINP: length 2
  Top Layer w0.137: v1(16.89,17.45) 16.84,17.45 16.29,16.9 C27.1
  Bottom Layer w0.137: v1(16.89,17.45) 16.79,17.45 16.47,17.13 U1.49
MIPIA-CSI-CK0N: length 17.6
  Top Layer w0.137: P1.8 11.83,5.67 v1(11.25,6.25)
  Inner2 w0.137: v1(11.25,6.25) 11.42,6.42 11.42,11.95 13.08,13.61 13.08,18.99 13.79,19.7 13.79,20.17 v1(13.63,20.33)
  Bottom Layer w0.137: U1.40 13.73,19.76 13.79,19.82 13.79,20.17 v1(13.63,20.33)
MIPIA-CSI-CK0P: length 17.6
  Top Layer w0.137: P1.9 11.33,6.78 v1(11.89,6.22)
  Inner2 w0.137: v1(11.89,6.22) 11.66,6.45 11.66,11.79 13.34,13.46 13.34,18.85 14.03,19.54 14.03,20.15 v1(14.2,20.32)
  Bottom Layer w0.137: U1.41 14.08,19.76 14.03,19.82 14.03,20.15 v1(14.2,20.32)
MIPIA-CSI-D0N: length 14.5
  Top Layer w0.137: P1.2 14.71,5.36 14.71,5.84 v1(14.33,6.22)
  Inner2 w0.137: v1(14.3,18.54) 14.47,18.37 14.47,6.47 14.33,6.33 v1(14.33,6.22)
  Bottom Layer w0.137: v1(14.3,18.54) 14.49,18.73 14.49,18.89 14.43,18.95 U1.42
MIPIA-CSI-D0P: length 14.6
  Top Layer w0.137: P1.3 14.33,6.78 v1(14.88,6.22)
  Inner2 w0.137: v1(14.88,6.22) 14.88,6.32 14.71,6.5 14.71,18.37 v1(14.88,18.54)
  Bottom Layer w0.137: v1(14.88,18.54) 14.72,18.7 14.72,18.92 14.78,18.97 U1.43
MIPIA-CSI-D1N: length 20.3
  Top Layer w0.137: v1(13.49,6.24) 13.33,6.4 P1.5
  Inner2 w0.137: v1(15.72,19.48) 15.72,19.26 15.31,18.85 15.31,18.49 15.93,17.88 15.93,7.03 16.24,6.71 16.24,5.78 15.66,5.2 13.73,5.2 13.29,5.64 13.29,6.05 v1(13.49,6.24)
  Bottom Layer w0.137: U1.44 15.32,19.1 15.52,19.1 15.72,19.3 v1(15.72,19.48)
MIPIA-CSI-D1P: length 20.8
  Top Layer w0.137: P1.6 12.83,6.15 v1(12.9,6.22)
  Inner2 w0.137: v1(12.9,6.22) 13.06,6.07 13.06,5.54 13.63,4.96 15.75,4.96 16.48,5.68 16.48,6.81 16.18,7.11 16.18,17.99 15.55,18.61 15.55,18.75 15.9,19.1 v1(16.13,19.1)
  Bottom Layer w0.137: v1(16.13,19.1) 15.95,19.1 15.75,18.9 15.75,18.67 U1.45
MIPIA_MCLK: length 23.6
  Top Layer w0.137: P1.12 9.83,5.43 10.58,6.17 v1(10.58,6.19)
  Inner1 w0.127: v1(12.29,21.23) 12.7,21.64 14.53,21.64 15.01,21.16 15.01,20.04 14.66,19.69 14.22,19.69 13.59,19.05 13.59,18.47 13.31,18.19 13.31,12.9 11.68,11.28 11.68,7.62 11,6.93 11,6.61 v1(10.58,6.19)
  Bottom Layer w0.137: v1(12.29,21.23) 12,20.94 12,20.47 12.19,20.27 12.19,19.91 12.33,19.78 U1.36
MIPIA_RSTN: length 15.7
  Top Layer w0.137: v1(10.36,7.92) 10.33,7.9 P1.11
  Inner1 w0.137: v1(10.36,7.92) 10.54,8.1 10.54,12.09 12.12,13.67 12.12,18.67 12.37,18.92 v1(12.37,20.62)
  Bottom Layer w0.137: v1(12.37,20.62) 12.52,20.47 12.52,19.96 12.68,19.81 U1.37
PD1: length 23.8
  Bottom Layer w0.102: 21.64,31.83 21.08,31.83 20.45,31.19 20.45,29.08 20.12,28.75 20.12,26.92 19.48,26.29 19.48,13.59 18.29,12.4 17.27,12.4 16.73,12.93 U1.61
PD2: length 21.5
  Bottom Layer w0.102: U1.62 16.65,12.58 17.09,12.14 18.49,12.14 19.79,13.44 19.79,26.03 20.47,26.72 20.47,28.55 21.21,29.29 21.64,29.29
PD3: length 19.5
  Bottom Layer w0.102: U1.63 16.49,12.23 16.89,11.84 18.72,11.84 20.12,13.23 20.12,25.86 21,26.75 21.64,26.75
PD4: length 17.5
  Inner2 w0.102: v1(20.09,12.57) 19.53,13.13 19.53,22.1 21.64,24.2 21.64,24.21
  Bottom Layer w0.102: U1.64 16.41,11.88 16.76,11.53 18.97,11.53 20.01,12.57 v1(20.09,12.57)
PD5: length 15.7
  Inner2 w0.102: v1(20.09,11.99) 20.45,12.34 20.45,12.75 19.89,13.31 19.89,20.35 21.21,21.67 21.64,21.67
  Bottom Layer w0.102: v1(20.09,11.99) 19.91,11.99 19.18,11.25 16.54,11.25 16.25,11.53 U1.65
PD6: length 13.5
  Inner2 w0.102: v1(20.09,11.43) 20.73,12.06 20.73,13.06 20.29,13.49 20.29,18.37 21.05,19.13 21.64,19.13
  Bottom Layer w0.102: U1.66 16.25,11.18 16.46,10.97 19.38,10.97 19.84,11.43 v1(20.09,11.43)
PD7: length 7.3
  Bottom Layer w0.102: U1.67 15.13,10.27 15.34,10.06 19.94,10.06 21.39,11.51 21.64,11.51
PD8: length 7.7
  Bottom Layer w0.102: U1.68 14.78,10.01 15.01,9.78 19.91,9.78 20.5,9.19 21.41,9.19 21.64,8.97
PD9: length 10.4
  Bottom Layer w0.102: 21.64,6.43 20.68,6.43 20.47,6.63 20.47,8.71 19.69,9.5 14.83,9.5 14.43,9.9 U1.69
PD10: length 12.5
  Bottom Layer w0.102: U1.70 14.08,9.77 14.68,9.17 19.46,9.17 20.12,8.51 20.12,6.4 20.68,5.84 20.68,4.78 21.56,3.89 21.64,3.89
PD11: length 15.3
  Bottom Layer w0.102: 21.64,1.35 21.64,1.76 20.55,2.84 20.55,4.44 20.32,4.67 20.32,5.66 19.76,6.22 19.76,8.36 19.23,8.89 14.58,8.89 13.87,9.6 13.72,9.6 13.38,9.94 U1.72
PD12: length 10.5
  Inner1 w0.102: 21.64,14.05 21.61,14.02 20.02,14.02 18.72,12.73 17.7,12.73 16.69,11.71 13.56,11.71 13.03,11.18 v1(13.03,10.92)
  Bottom Layer w0.102: U1.73 v1(13.03,10.92)
PD13: length 15.1
  Inner3 w0.102: v1(12.68,9.88) 9.78,12.78 8.61,12.78 8.48,12.65 4.78,12.65 2.59,14.83 2.59,15.67 1.68,16.59 1.52,16.59
  Bottom Layer w0.102: U1.74 v1(12.68,9.88) 12.7,9.86
PD14: length 12.2
  Inner1 w0.102: 21.64,16.59 21.11,16.59 16.54,12.01 13.32,12.01 v1(12.48,11.18)
  Bottom Layer w0.102: U1.75 12.33,11.06 12.45,11.18 v1(12.48,11.18)
PD15: length 19.6
  Inner3 w0.102: 1.52,19.13 1.52,19.02 2.95,17.6 2.95,14.99 4.98,12.95 8.25,12.95 8.46,13.16 9.96,13.16 13.23,9.88 v1(13.23,9.45)
  Bottom Layer w0.102: U1.76 11.98,10.04 12.52,9.5 13.18,9.5 v1(13.23,9.45)
PD16: length 16.4
  Inner3 w0.102: 1.52,14.05 2.77,14.05 4.5,12.32 8.76,12.32 8.86,12.42 9.55,12.42 13.08,8.89 v1(13.23,8.89)
  Bottom Layer w0.102: U1.77 11.63,9.96 12.4,9.19 12.75,9.19 13.06,8.89 v1(13.23,8.89)
PD17: length 17.2
  Inner3 w0.102: 1.52,11.51 1.73,11.51 2.59,10.64 3.25,10.64 4.55,11.94 8.89,11.94 9.02,12.06 9.45,12.06 v1(13.18,8.33)
  Bottom Layer w0.102: v1(13.18,8.33) 12.6,8.92 12.32,8.92 11.28,9.95 U1.78
PD18: length 19.9
  Inner3 w0.102: v1(12.61,8.32) 10.44,10.49 9.7,10.49 9.25,10.95 5.28,10.95 3.56,9.22 3.56,6.35 1.52,4.32 1.52,3.89
  Bottom Layer w0.102: v1(12.61,8.32) 12.61,8.37 12.33,8.65 12.18,8.65 10.93,9.9 U1.79
PD19: length 21.2
  Inner3 w0.102: 1.52,1.35 1.52,1.52 2.67,2.67 2.67,4.88 3.94,6.15 3.94,9.02 5.54,10.62 9.07,10.62 9.5,10.19 10.16,10.19 v1(12.05,8.29)
  Bottom Layer w0.102: U1.80 10.58,9.82 12.05,8.34 v1(12.05,8.29)
PD22: length 11.8
  Inner3 w0.102: v1(9.7,11.23) 5,11.23 3.15,9.37 3.15,8.25 1.52,6.63 1.52,6.43
  Bottom Layer w0.127: v1(9.7,11.23) 9.7,11.05 9.88,10.87 U1.82
PD23: length 10.2
  Inner3 w0.102: v1(9.25,11.66) 9.14,11.56 4.75,11.56 2.57,9.37 1.93,9.37 1.52,8.97
  Bottom Layer w0.127: v1(9.25,11.66) 9.25,11.13 9.53,10.84 U1.83
PL2: length 23.8
  Bottom Layer w0.102: 1.52,34.37 1.52,34.32 2.74,33.1 2.74,31.55 3.07,31.22 3.07,28.19 3.94,27.33 3.94,15.37 5.21,14.1 6.2,14.1 6.66,13.63 U1.8
PL3: length 21.9
  Bottom Layer w0.102: 1.52,31.83 1.88,31.83 2.69,31.01 2.69,28.02 3.61,27.1 3.61,15.21 4.98,13.84 6.02,13.84 6.58,13.28 U1.7
PL6: length 17.3
  Inner3 w0.102: 1.52,24.21 2.11,24.21 2.87,23.44 2.87,22.35 2.57,22.05 2.57,21.16 4.44,19.28 4.44,14.4 5.23,13.61 7.59,13.61 v1(7.72,13.74)
  Bottom Layer w0.152: v1(7.72,13.74) 7.72,12.5 7.46,12.23 U1.4
PL7: length 15
  Inner3 w0.102: 1.52,21.67 1.52,21.59 4.12,19 4.12,14.33 5.13,13.31 v1(8.1,13.31)
  Bottom Layer w0.152: U1.3 7.62,11.88 8.05,12.32 8.05,13.26 v1(8.1,13.31)
PMC_EN0: length 22.8
  Top Layer w0.203: v1(7.09,24.23) 7.49,24.63 U3.8 ; U3.18 12.25,24.63 v1(12.5,24.38)
  Inner3 w0.152: v1(7.09,24.23) 5.64,22.78 5.64,14.5 6.07,14.07 6.66,14.07 6.91,14.33 v1(7.54,14.33)
  Inner3 w0.203: v1(7.09,24.23) 7.49,24.64 8.38,24.64 9.55,23.47 10.39,23.47 10.87,23.95 12.06,23.95 v1(12.5,24.38)
  Bottom Layer w0.102: v1(7.54,14.33) 7.54,14.33 U1.10
  Bottom Layer w0.152: v1(7.09,24.23) 7.09,23.71 R26.2
SDC0_CLK: length 25.8
  Bottom Layer w0.127: U2.5 12.36,35.22 12.73,35.59 12.73,36.32 12.45,36.6 5.61,36.6 4.24,35.23 4.24,28.78 5.05,27.97 5.05,21.15 R4.1
SDC0_CMD: length 25.8
  Bottom Layer w0.127: U1.19 6.27,17.48 5.56,18.19 5.56,21.31 5.44,21.44 5.44,28.14 4.6,28.98 4.6,34.9 5.84,36.14 7.62,36.14 8.03,35.74 8.61,35.74 9.04,35.31 9.47,35.31 10.16,34.62 ; 10.16,34.64 U2.3
SDC0_D0: length 33.7
  Bottom Layer w0.127: 14.56,34.37 14.56,34.66 13.87,35.36 13.49,35.36 13.16,35.69 13.16,36.42 12.55,37.03 5.41,37.03 3.86,35.48 3.86,28.58 4.67,27.76 4.67,17.98 5.87,16.78 U1.17
SDC0_D1: length 36.3
  Bottom Layer w0.127: U2.8 15.66,34.68 15.01,35.33 14.53,35.33 14.12,35.74 13.77,35.74 13.54,35.97 13.54,36.68 12.8,37.41 5.18,37.41 3.48,35.71 3.48,28.37 4.32,27.53 4.32,17.75 5.64,16.43 U1.16
SDC0_D2: length 20.4
  Bottom Layer w0.127: 7.96,34.37 7.96,34.61 7.44,35.13 6.3,35.13 5.38,34.21 5.38,29.36 6.22,28.52 6.22,21.84 6.35,21.72 6.35,18.42 6.58,18.18 U1.21
SDC0_D3: length 23.1
  Bottom Layer w0.127: U1.20 6.45,17.83 5.97,18.31 5.97,21.46 5.84,21.59 5.84,28.3 4.95,29.18 4.95,34.59 5.92,35.56 7.59,35.56 7.87,35.28 8.46,35.28 9.06,34.68 9.06,34.37
SDC0_DC: length 4.8
  Bottom Layer w0.127: U1.28 9.53,20.87 9.22,21.18 7.71,21.18 R8.2
SPI0_CLK: length 6.7
  Top Layer w0.127: U4.6 12.01,16.43 10.62,17.83 10.62,19.38 9.25,20.75 v1(9.02,20.75)
  Bottom Layer w0.127: R5.1 8.95,20.82 v1(9.02,20.75)
SPI0_CS: length 5.2
  Top Layer w0.127: v1(8.97,19.99) 8.94,19.96 6.45,19.96 5.74,19.25 5.22,19.25 U4.1
  Bottom Layer w0.127: U1.26 8.83,19.85 v1(8.97,19.99)
SPI0_HOLD: length 10.4
  Top Layer w0.127: v1(7.29,20.45) 7.66,20.82 8.29,20.82 8.6,21.12 9.39,21.12 11.02,19.48 11.02,18.19 11.51,17.7 U4.7
  Top Layer w0.254: R17.2 13.63,17.7 U4.7
  Bottom Layer w0.127: v1(7.29,20.45) 7.29,20.14 7.78,19.65 U1.23
SPI0_MISO: length 6.3
  Top Layer w0.127: U4.2 5.44,17.7 6.25,18.52 6.25,19.15 6.63,19.53 v1(7.21,19.53)
  Bottom Layer w0.127: U1.27 9.18,19 8.96,18.77 7.65,18.77 7.44,18.97 7.44,19.3 v1(7.21,19.53)
SPI0_MOSI: length 9.4
  Top Layer w0.127: U4.5 11.99,15.16 11.3,15.85 11.3,16.46 10.21,17.55 10.21,19.3 9.16,20.36 7.94,20.36 v1(7.85,20.45)
  Bottom Layer w0.127: v1(7.85,20.45) 7.85,20.12 8.13,19.83 U1.24
SPI0_WP: length 5.9
  Top Layer w0.127: v1(6.81,19.13) 6.71,19.02 6.71,18.31 6.12,17.73 6.12,17.14 5.38,16.41 4.96,16.41 U4.3
  Top Layer w0.152: U4.3 4.75,16.62 R14.1
  Bottom Layer w0.127: v1(6.81,19.13) 6.91,19.02 6.91,18.65 U1.22
TWI0_SCK: length 19
  Top Layer w0.137: v1(9.8,7.95) 9.33,7.48 P1.13
  Inner1 w0.137: v1(12.9,21.16) 12.75,21.01 12.75,18.64 12.52,18.42 12.52,13.44 10.9,11.81 10.9,7.91 10.53,7.53 10.22,7.53 v1(9.8,7.95)
  Bottom Layer w0.137: R24.2 v1(12.9,21.16) 12.85,21.11 12.85,20.02 13.03,19.84 U1.38
TWI0_SDA: length 21.1
  Top Layer w0.137: v1(9.93,6.27) 9.78,6.12 9.4,6.12 8.83,5.56 P1.14
  Inner1 w0.137: v1(9.93,6.27) 9.93,6.3 10.21,6.58 10.44,6.58 10.67,6.81 10.67,7.16 11.28,7.77 11.28,11.56 12.88,13.16 12.88,18.24 13.16,18.52 13.16,20.75 13.51,21.11 v1(13.51,21.23)
  Bottom Layer w0.137: 13.56,21.83 13.51,21.78 v1(13.51,21.23) 13.51,21.11 13.18,20.78 13.18,20.25 13.38,20.05 U1.39
UART0_RX: length 32.7
  Top Layer w0.152: v1(10.34,30.63) 10.33,30.64 USB1.A8
  Inner2 w0.127: 1.52,26.75 1.52,26.85 2.74,28.07 2.74,30.05 v1(2.29,30.51)
  Inner3 w0.137: v1(10.34,30.63) 9.96,30.25 2.54,30.25 v1(2.29,30.51)
  Bottom Layer w0.102: 1.52,26.75 1.8,27.03 2.63,27.03 2.9,26.76 2.9,14.96 4.6,13.26 5.77,13.26 6.44,12.58 U1.5
UART0_TX: length 34.5
  Top Layer w0.152: v1(13.89,30.35) 13.69,30.35 13.33,30.71 USB1.B8
  Inner3 w0.137: v1(13.89,30.35) 10.69,30.35 10.24,29.9 2.97,29.9 2.36,29.29 1.52,29.29
  Bottom Layer w0.102: 1.52,29.29 1.57,29.29 2.36,28.5 2.36,27.81 3.25,26.92 3.25,15.04 4.75,13.54 5.89,13.54 6.5,12.93 U1.6
VRA1: length 1.8
  Bottom Layer w0.254: 17.51,15.77 17.2,16.08 U1.52
$1N29215: length 2.6
  Bottom Layer w0.152: U1.86 8.48,7.91 8.43,7.86
$1N78208: length 2.9
  Bottom Layer w0.381: U2.4 11.26,34.76 10.34,35.69 C63.2 11.25,36 R27.1
$1N78221: length 8.1
  Bottom Layer w0.127: R8.1 6.66,22.72 6.66,28.74 7.05,29.13 7.05,30.4
$1N78347: length 1.2
  Bottom Layer w0.152: R2.2 8.48,6.82 R1.1 8.48,6.8 R3.1
$1N78353: length 4.4
  Bottom Layer w0.152: R3.2 8.48,2.25 ANT1.2
$1N79510: length 1.1
  Top Layer w0.152: R6.2 3.48,34.85 LED1.1
$1N80715: length 1.2
  Top Layer w0.152: USB1.B5 9.83,32 R15.2
$1N80801: length 1.3
  Top Layer w0.152: R16.1 12.83,30.79 USB1.A5
$1N82766: length 1.7
  Top Layer w0.203: U3.14 10.52,22.08 R9.2 R7.1
$1N83072: length 2.1
  Top Layer w0.203: R11.2 R10.1 9.8,27.34 10.12,27.02 U3.3
$1N83335: length 2
  Top Layer w0.203: U3.2 10.52,27.35 R13.2 R12.1
$1N83538: length 4.8
  Bottom Layer w0.127: R4.2 5.16,18.06 6.08,17.13 U1.18
$1N83564: length 1
  Bottom Layer w0.127: R5.2 8.48,19.3 U1.25
$1N85174: length 1.2
  Top Layer w0.127: C27.2 R18.1 17.45,16.8 R20.1
$1N85232: length 1.1
  Top Layer w0.152: C29.1 R18.2 R23.1
$1N85237: length 1.5
  Top Layer w0.127: R21.1 19.1,16.24 C28.2
  Top Layer w0.152: 19.74,16.32 19.67,16.26 C28.2
$1N85241: length 1.2
  Top Layer w0.152: C29.2 19.72,16.81 R19.2 19.74,17.36 R22.2
$1N85511: length 2.1
  Top Layer w0.127: MIC1.2 17.78,13.9 17.78,14.85 C31.1 R21.2
$1N85515: length 4
  Top Layer w0.127: MIC1.1 17.3,13.31 17.3,14.07 17.45,14.22 R20.2 17.34,15.71 17.22,15.83 17.22,15.84 17.12,15.93 17.11,15.93 C30.2

## Copper pours and planes (outline as drawn; the poured copper is in the pictures)
0V9 on Top Layer: 15.93,27.84 18.11,27.84 18.11,23.22 15.93,23.22
0V9 on Bottom Layer: 6.71,19.61 16.23,19.61 16.23,10.14 6.71,10.14
1V5 on Top Layer: 5.05,30.25 8.69,30.25 8.69,27.07 5.05,27.07
3V3 on Top Layer: 1.75,25.15 6.66,25.15 6.66,22.4 1.75,22.4
GND on Top Layer: -5.74,40.21 28.5,40.21 28.5,-5.18 -5.74,-5.18
GND on Bottom Layer: -3.45,38.43 26.16,38.43 26.16,-2.13 -3.45,-2.13
GND on Inner1: -4.75,40.13 27.31,40.13 27.31,-3.12 -4.75,-3.12
GND on Inner2: -3.89,38.51 27.08,38.51 27.08,-2.57 -3.89,-2.57
GND on Inner3: -5.08,38.73 27.79,38.73 27.79,-4.11 -5.08,-4.11
GND on Inner4: -4.09,38.89 26.59,38.89 26.59,-2.67 -4.09,-2.67
VBUS on Top Layer: 7.52,24.33 9.02,24.33 9.02,23.27 7.52,23.27
VBUS on Top Layer: 11.2,25.17 13.77,25.17 13.77,24.59 11.2,24.59
VBUS on Bottom Layer: 7.52,24.33 9.02,24.33 9.02,23.27 7.52,23.27
$1N82929 on Top Layer: 4.96,23.55 9.42,23.55 9.42,21.59 4.96,21.59
$1N83076 on Top Layer: 5.49,26.35 9.02,26.35 9.02,25.32 5.49,25.32
$1N83339 on Top Layer: 11.2,26.29 15.29,26.29 15.29,24.56 11.2,24.56

Small or netless copper shapes (teardrops, artwork), in the pictures only: 181 on Top Layer, 254 on Bottom Layer, 16 on Inner1, 46 on Inner2, 32 on Inner3

## Text on the board
Bottom Silkscreen Layer: 3V3 | PL2 | PL3 | PL4 | PL5 | PL6 | PL7 | PD15 | PD13 | PD16 | PD17 | PD23 | PD22 | PD18 | PD19 | A- | A+ | GND | ADC | PD1 | PD2 | PD3 | PD4 | PD5 | PD6 | PD14 | PD12 | PD7 | PD8 | PD9 | PD10 | PD11 | V1.4 | TF Card/JTAG
Top Silkscreen Layer: FEL | CSI
